# EAGLE design OCTO_CONTROLER_V1.2 (EAGLE 6.5.0)
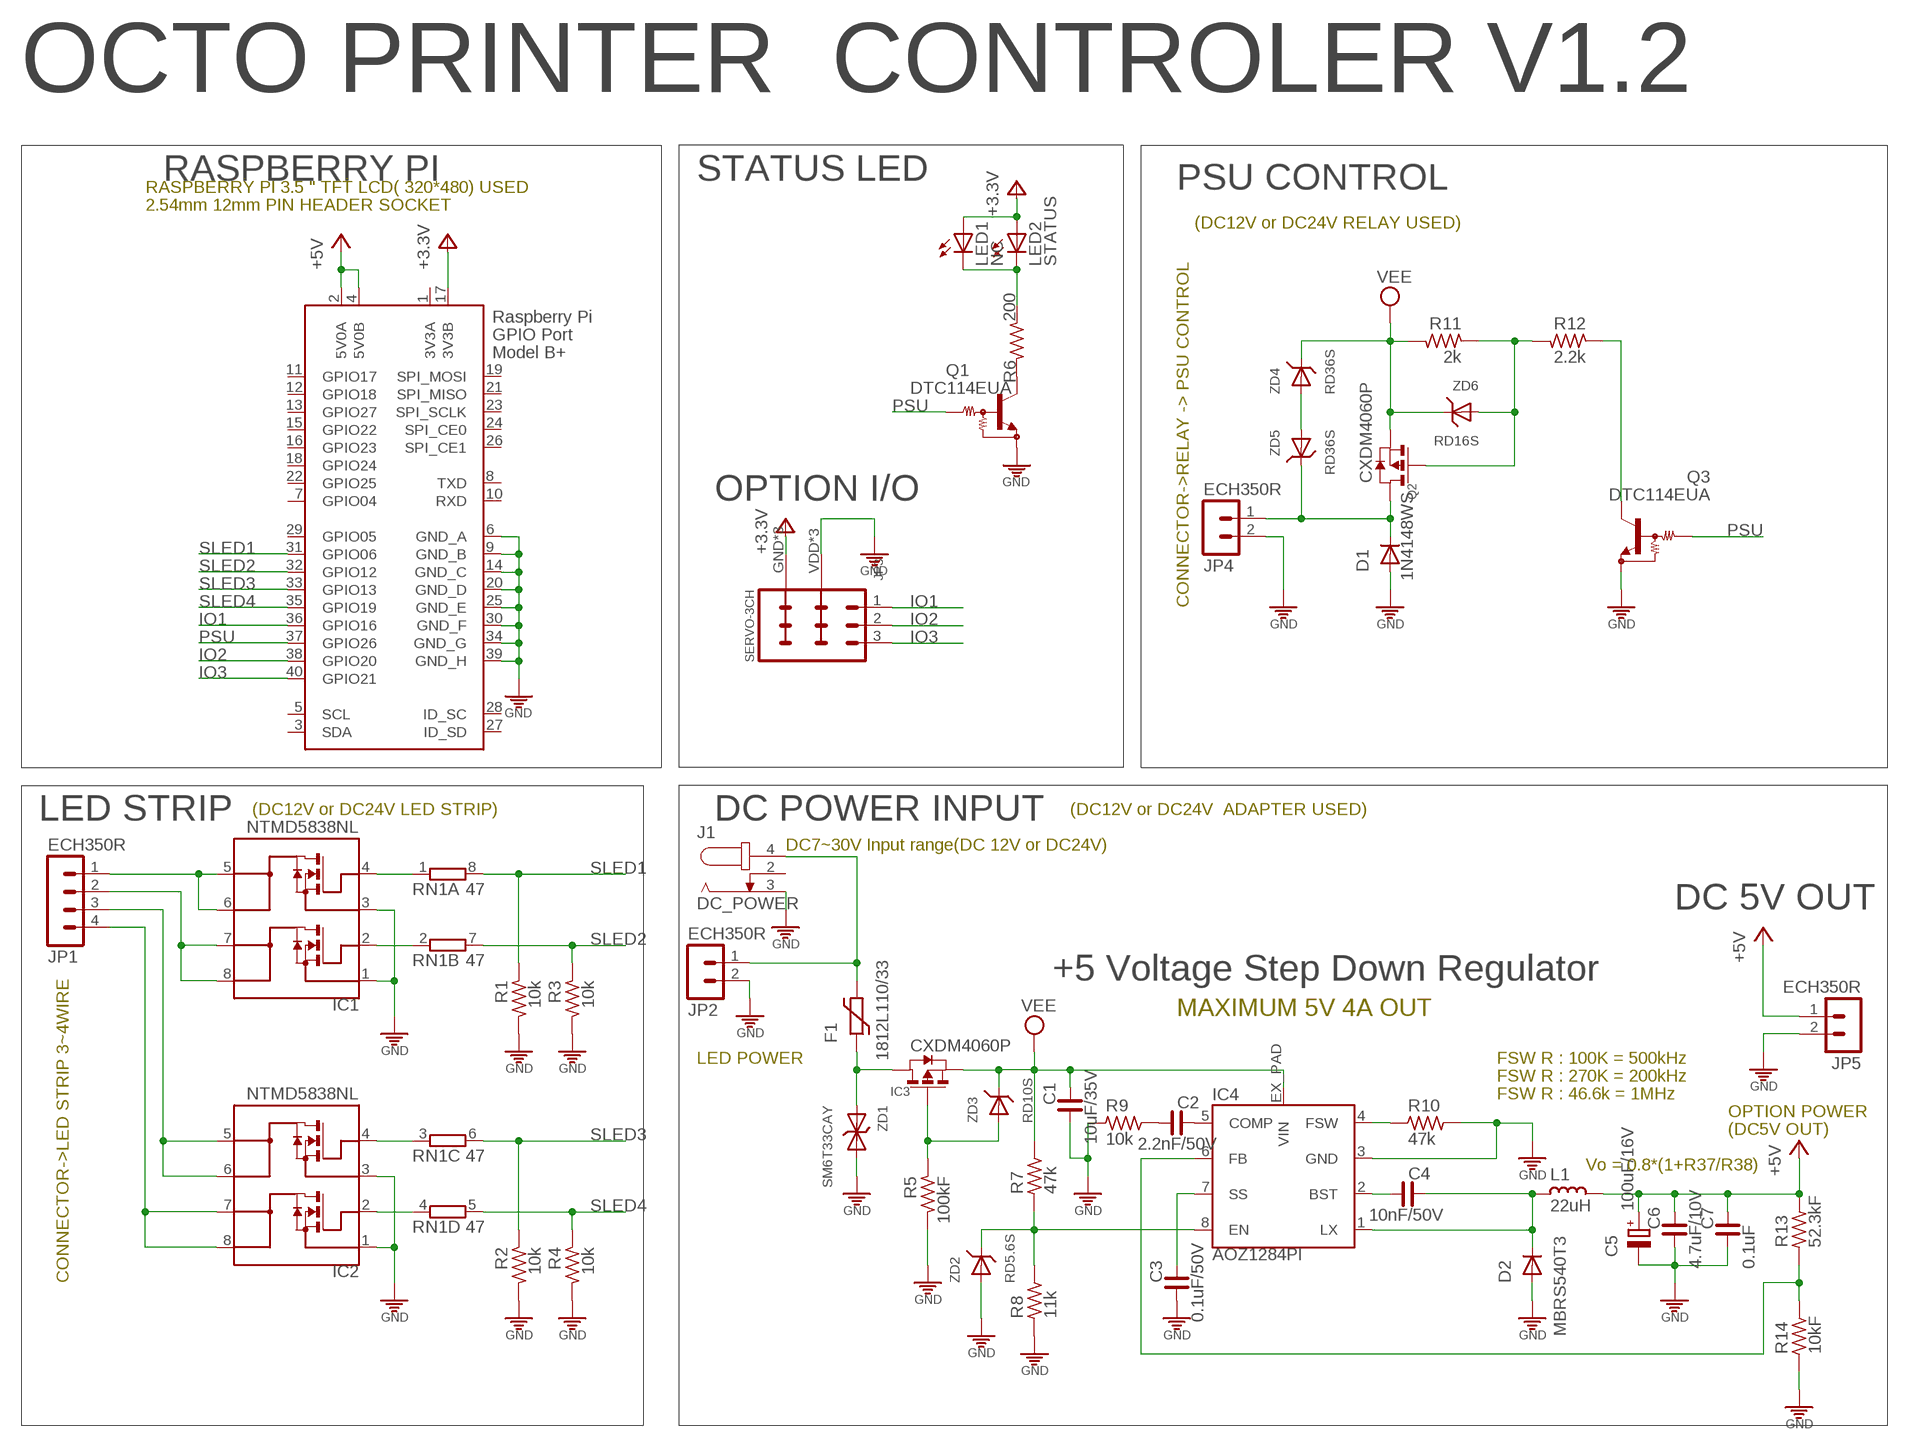
[diagram p0: schematic, sheet 1]

## Parts
C1  10uF/35V  C_3225  [C3225]
C2  2.2nF/50V  C_0603  [C0603]
C3  0.1uF/50V  C_0603  [C0603]
C4  10nF/50V  C_0603  [C0603]
C5  100uF/16V  CPOL-EUD/7343-31W  [D/7343-31W]
C6  4.7uF/10V  C_2012  [C2012]
C7  0.1uF  C_0603  [C0603]
D1  1N4148WS  B5189WN  [SOD323]
D2  MBRS540T3  DIODE-SMC  [SMC]
F1  1812L110/33  1812L  [1812L]
IC1  NTMD5838NL  N-DUAL-FET  [SO08]
IC2  NTMD5838NL  N-DUAL-FET  [SO08]
IC3  CXDM4060P  CXDM4060PCXDM4060P  [SOT89]
IC4  AOZ1284PI  [S08-EP1]
J1  DC_POWER  DC-JACK005A  [DC-005]
JP1  ECH350R  MA04-1ECHR350R  [ECH350R-04]
JP2  ECH350R  MA02ECH350R  [ECH350R-02]
JP3  SERVO-3CH  [SERVO-3CH1]
JP4  ECH350R  MA02ECH350R  [ECH350R-02]
JP5  ECH350R  MA02ECH350R  [ECH350R-02]
L1  22uH  L_SHP1260P-F  [SHP1260P-F]
LED1  NC  LEDSMD-1608  [LED-1608]
LED2  STATUS  LED3FG2HD-T1  [3FG2HD-T1]
Q1  DTC114EUA  [SC59-BEC]
Q2  CXDM4060P  CXDM4060PCXDM4060P  [SOT89]
Q3  DTC114EUA  [SC59-BEC]
R1  10k  R_0603  [R0603]
R2  10k  R_0603  [R0603]
R3  10k  R_0603  [R0603]
R4  10k  R_0603  [R0603]
R5  100kF  R_0603  [R0603]
R6  200  R_0603  [R0603]
R7  47k  R_0603  [R0603]
R8  11k  R_0603  [R0603]
R9  10k  R_0603  [R0603]
R10  47k  R_0603  [R0603]
R11  2k  R_0603  [R0603]
R12  2.2k  R_0603  [R0603]
R13  52.3kF  R_0603  [R0603]
R14  10kF  R_0603  [R0603]
RN1  47  4R-N  [ARRAY_R3216]
X1  RASPI_BOARD_B+#_F  [RASPI_BOARD_B+_FULL]
ZD1  SM6T33CAY  ZDSM6T33CAY  [SMB]
ZD2  RD5.6S  ZENER_DIODERD47S  [DSMM]
ZD3  RD10S  ZENER_DIODERD47S  [DSMM]
ZD4  RD36S  ZENER_DIODERD47S  [DSMM]
ZD5  RD36S  ZENER_DIODERD47S  [DSMM]
ZD6  RD16S  ZENER_DIODERD47S  [DSMM]

## Nets
3V3: JP3.GND JP3.GND@1(GND) JP3.GND@2(GND) LED1.A LED2.A X1.17(3V3B) ; supply symbol labelled +3V3
+5V: C5.+ C6.1 C7.1 JP5.1 L1.1 R13.2 X1.2(5V0A) X1.4(5V0B)
DC-IN: F1.P$1 IC3.2(D) IC3.2@1(D) ZD1.A
GND [GND]: C1.2 C3.2 C5.- C6.2 C7.2 D1.A D2.A IC1.1 IC1.3 IC2.1 IC2.3 IC4.3(GND) J1.3 JP2.2 JP3.VDD(+5V) JP3.VDD@1(+5V) JP3.VDD@2(+5V) JP4.2 JP5.2 Q1.1(GND) Q3.1(GND) R1.2 R2.2 R3.2 R4.2 R5.2 R8.1 R9.1 R10.2 R14.1 X1.6(GND_A) X1.9(GND_B) X1.14(GND_C) X1.20(GND_D) X1.25(GND_E) X1.30(GND_F) X1.34(GND_G) X1.39(GND_H) ZD1.C(K) ZD2.A
IO1: JP3.1 X1.36(GPIO16)
IO2: JP3.2 X1.38(GPIO20)
IO3: JP3.3 X1.40(GPIO21)
N$1: Q2.3(G) R11.1 R12.2 ZD6.A
N$2: LED1.C LED2.K(C) R6.1
N$3: ZD4.A ZD5.A
N$4: IC1.2 RN1.2
N$7: IC1.4 RN1.1
N$8: IC2.2 RN1.4
N$12: IC4.6(FB) R13.1 R14.2
N$13: IC2.4 RN1.3
N$14: C4.2 IC4.2(BST)
N$15: D1.C JP4.1 Q2.2(D) Q2.2@1(D) ZD5.C
N$27: C4.1 D2.C IC4.1(LX) L1.2
N$28: IC4.4(FSW) R10.1
N$29: C3.1 IC4.7(SS)
N$30: IC4.8(EN) R7.1 R8.2 ZD2.C
N$31: C2.1 IC4.5(COMP)
N$32: Q3.3(OUT) R12.1
N$34: C2.2 R9.2
N$77: Q1.3(OUT) R6.2
N$98: IC3.3(G) R5.1 ZD3.A
N$99: F1.P$2 J1.4 JP2.1
PSU: Q1.2(IN) Q3.2(IN) X1.37(GPIO26)
S-LED1: IC1.5 IC1.6 JP1.1
S-LED2: IC1.7 IC1.8 JP1.2
S-LED3: IC2.5 IC2.6 JP1.3
S-LED4: IC2.7 IC2.8 JP1.4
SLED1: R1.1 RN1.8 X1.31(GPIO06)
SLED2: R3.1 RN1.7 X1.32(GPIO12)
SLED3: R2.1 RN1.6 X1.33(GPIO13)
SLED4: R4.1 RN1.5 X1.35(GPIO19)
VEE: C1.1 IC3.1(S) IC4.EX_PAD(VIN) Q2.1(S) R7.2 R11.2 ZD3.C ZD4.C ZD6.C
Unconnected: J1.2 X1.3(SDA) X1.5(SCL) X1.7(GPIO04) X1.8(TXD) X1.10(RXD) X1.11(GPIO17) X1.12(GPIO18) X1.13(GPIO27) X1.15(GPIO22) X1.16(GPIO23) X1.18(GPIO24) X1.19(SPI_MOSI) X1.21(SPI_MISO) X1.22(GPIO25) X1.23(SPI_SCLK) X1.24(SPI_CE0) X1.26(SPI_CE1) X1.27(ID_SD) X1.28(ID_SC) X1.29(GPIO05)

## Notes on the sheet
- OCTO PRINTER  CONTROLER V1.2
- PSU CONTROL
- RASPBERRY PI 3.5 " TFT LCD( 320*480) USED | RASPBERRY PI | STATUS LED
- 2.54mm 12mm PIN HEADER SOCKET
- (DC12V or DC24V RELAY USED)
- OPTION I/O
- CONNECTOR->RELAY -> PSU CONTROL
- (DC12V or DC24V LED STRIP) | (DC12V or DC24V  ADAPTER USED)
- LED STRIP | DC POWER INPUT
- DC7~30V Input range(DC 12V or DC24V)
- DC 5V OUT
- +5 Voltage Step Down Regulator
- MAXIMUM 5V 4A OUT
- LED POWER | FSW R : 100K = 500kHz
- FSW R : 270K = 200kHz
- FSW R : 46.6k = 1MHz
- OPTION POWER
- (DC5V OUT)
- Vo = 0.8*(1+R37/R38)
- CONNECTOR->LED STRIP 3~4WIRE

## Power pins joined to a net without a drawn wire
3V3A: X1.1(3V3A)

## Library data of the parts
C1-C4 C6 C7 = cona_lib:C_: NON-POLARIZED CAP
C5 = cona_lib:CPOL-EU: POLARIZED CAPACITOR, European symbol
D1 = cona_lib:B5189W
D2 = diode:DIODE-: DIODE
F1 = ptc-littlefuse:1812L
IC1 IC2 = cona_lib:N-DUAL-FET
IC3 Q2 = cona_lib:CXDM4060P
IC4 = cona_lib:AOZ1284PI
J1 = cona_lib:DC-JACK
JP1 = cona_lib:MA04-1: PIN HEADER
JP2 JP4 JP5 = cona_lib:MA02
JP3 = cona_lib:SERVO-3CH
L1 = cona_lib:L_: INDUCTOR
LED1 LED2 = cona_lib:LED: LED OSRAM: - CHIPLED LG R971, LG N971, LY N971, LG Q971, LY Q971, LO R971, LY R971 LH N974, LH R974 LS Q976, LO Q976, LY Q976 LO Q996 - Hyper CHIPLED LW Q18S LB Q993, LB Q99A, LB R99A - SideLED LS A670, LO A670, LY A670, LG A670, LP A670 LB A673, LV A673, LT A673, LW A673 LH A674 LY A675 LS A676, LA A676, LO A676, LY A676, LW A676 LS A679, LY A679, LG A679 - Hyper Micro SIDELED® LS Y876, LA Y876, LO Y876, LY Y876 LT Y87S - SmartLED LW L88C, LW L88S LB L89C, LB L89S, LG L890 LS L89K, LO L89K, LY L89K LS L896, LA L896, LO L896, LY L896 - TOPLED LS T670, LO T670, LY T670, LG T670, LP T670 LSG T670, LSP T670, LSY T670, LOP T670, LYG T670 LG T671, LOG T671, LSG T671 LB T673, LV T673, LT T673, LW T673 LH T674 LS T676, LA T676, LO T676, LY T676, LB T676, LH T676, LSB T676, LW T676 LB T67C, LV T67C, LT T67C, LS T67K, LO T67K, LY T67K, LW E67C LS E67B, LA E67B, LO E67B, LY E67B, LB E67C, LV E67C, LT E67C LW T67C LS T679, LY T679, LG T679 LS T770, LO T770, LY T770, LG T770, LP T770 LB T773, LV T773, LT T773, LW T773 LH T774 LS E675, LA E675, LY E675, LS T675 LS T776, LA T776, LO T776, LY T776, LB T776 LHGB T686 LT T68C, LB T68C - Hyper Mini TOPLED® LB M676 - Mini TOPLED Santana® LG M470 LS M47K, LO M47K, LY M47K Source: http://www.osram.convergy.de LUXEON: - LUMILED® LXK2-PW12-R00, LXK2-PW12-S00, LXK2-PW14-U00, LXK2-PW14-V00 LXK2-PM12-R00, LXK2-PM12-S00, LXK2-PM14-U00 LXK2-PE12-Q00, LXK2-PE12-R00, LXK2-PE12-S00, LXK2-PE14-T00, LXK2-PE14-U00 LXK2-PB12-K00, LXK2-PB12-L00, LXK2-PB12-M00, LXK2-PB14-N00, LXK2-PB14-P00, LXK2-PB14-Q00 LXK2-PR12-L00, LXK2-PR12-M00, LXK2-PR14-Q00, LXK2-PR14-R00 LXK2-PD12-Q00, LXK2-PD12-R00, LXK2-PD12-S00 LXK2-PH12-R00, LXK2-PH12-S00 LXK2-PL12-P00, LXK2-PL12-Q00, LXK2-PL12-R00 Source: www.luxeon.com KINGBRIGHT: KA-3528ASYC Source: www.kingbright.com
Q1 Q3 = cona_lib:DTC114EUA: NPN Bias Resistor Transistor
R1-R14 = cona_lib:R_: RESISTOR
RN1 = cona_lib:4R-N: Array Chip Resistor Source: RS Component / Phycomp
X1 = raspberrypi_bastelstube_v13:RASPI_BOARD_B+#: Raspberry Pi GPIO connector with markings for the outer dimensions of the Raspberry Pi board model B+ with different sets of drill holes or mounting pads All pins connected
ZD1 = GRU-EURO6:ZD
ZD2-ZD6 = GRU-EURO6:ZENER_DIODE

## Net classes
0 default: clearance 0.152 mm
1 power: width 0.152 mm
2 GND: width 0.152 mm, clearance 0.152 mm

## Board
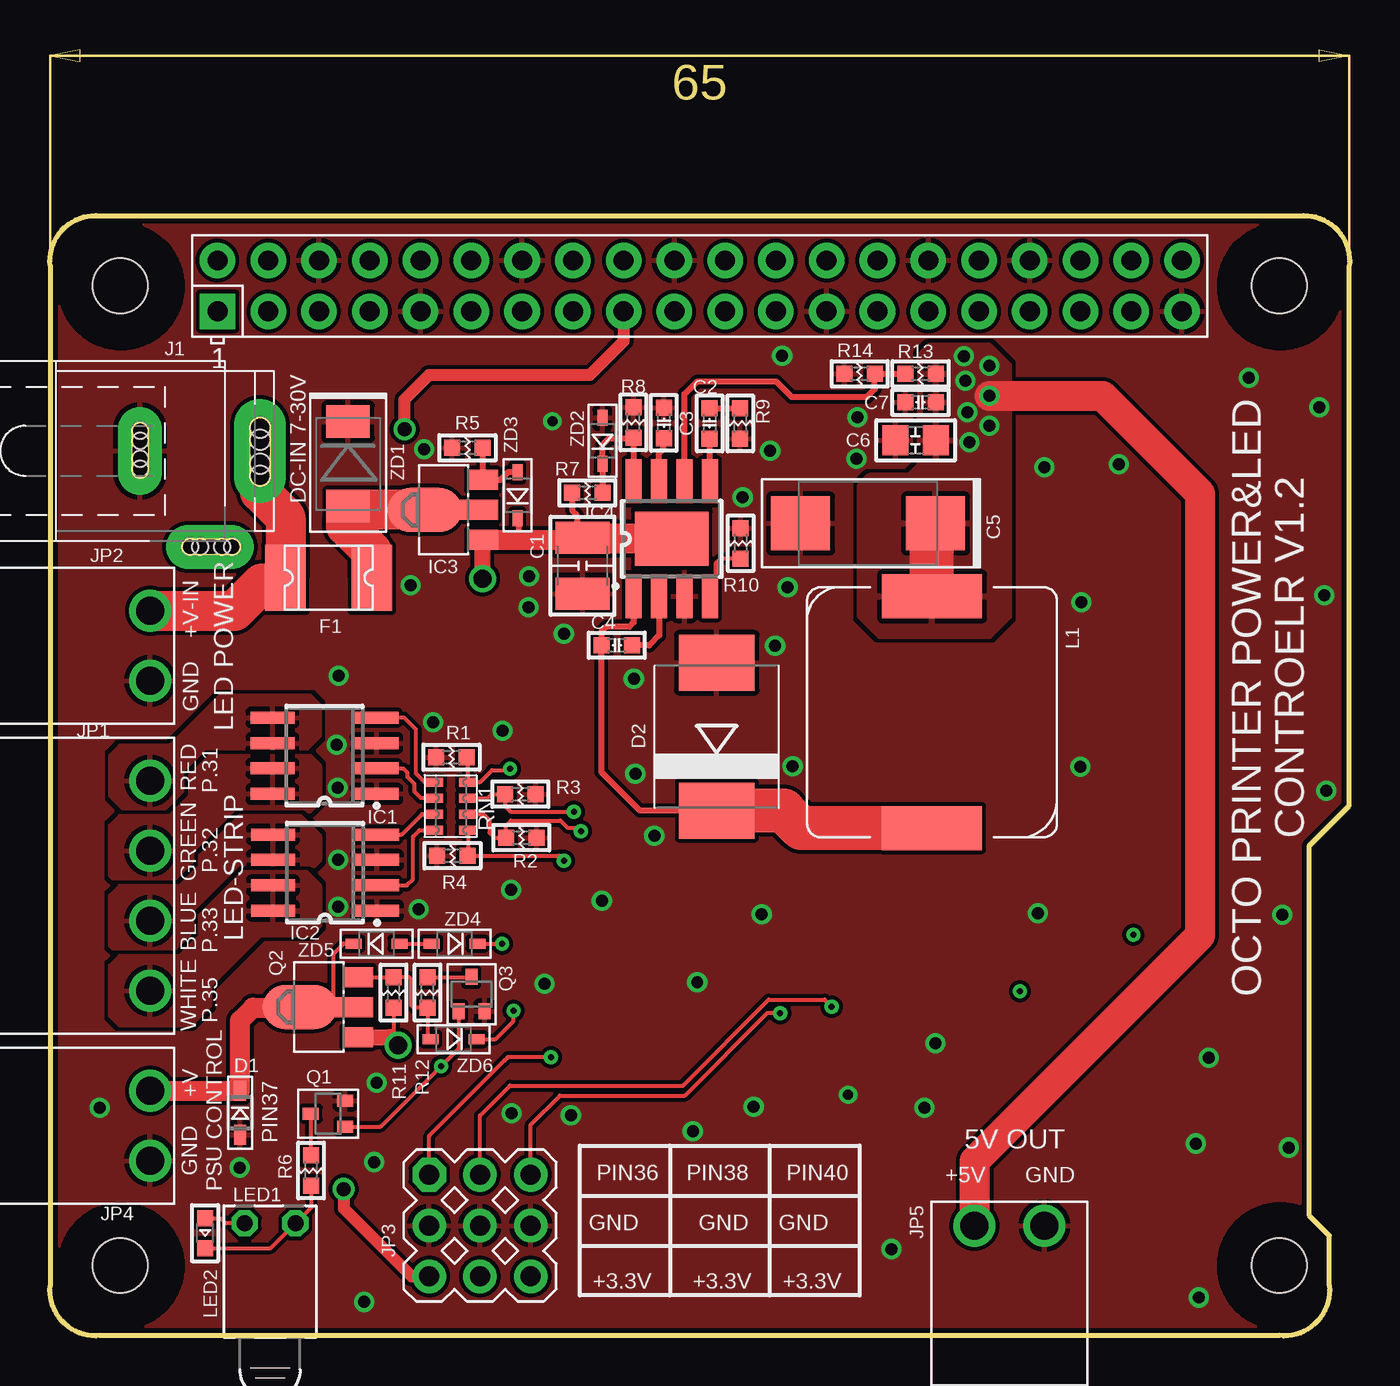
[diagram p1: board, top side]
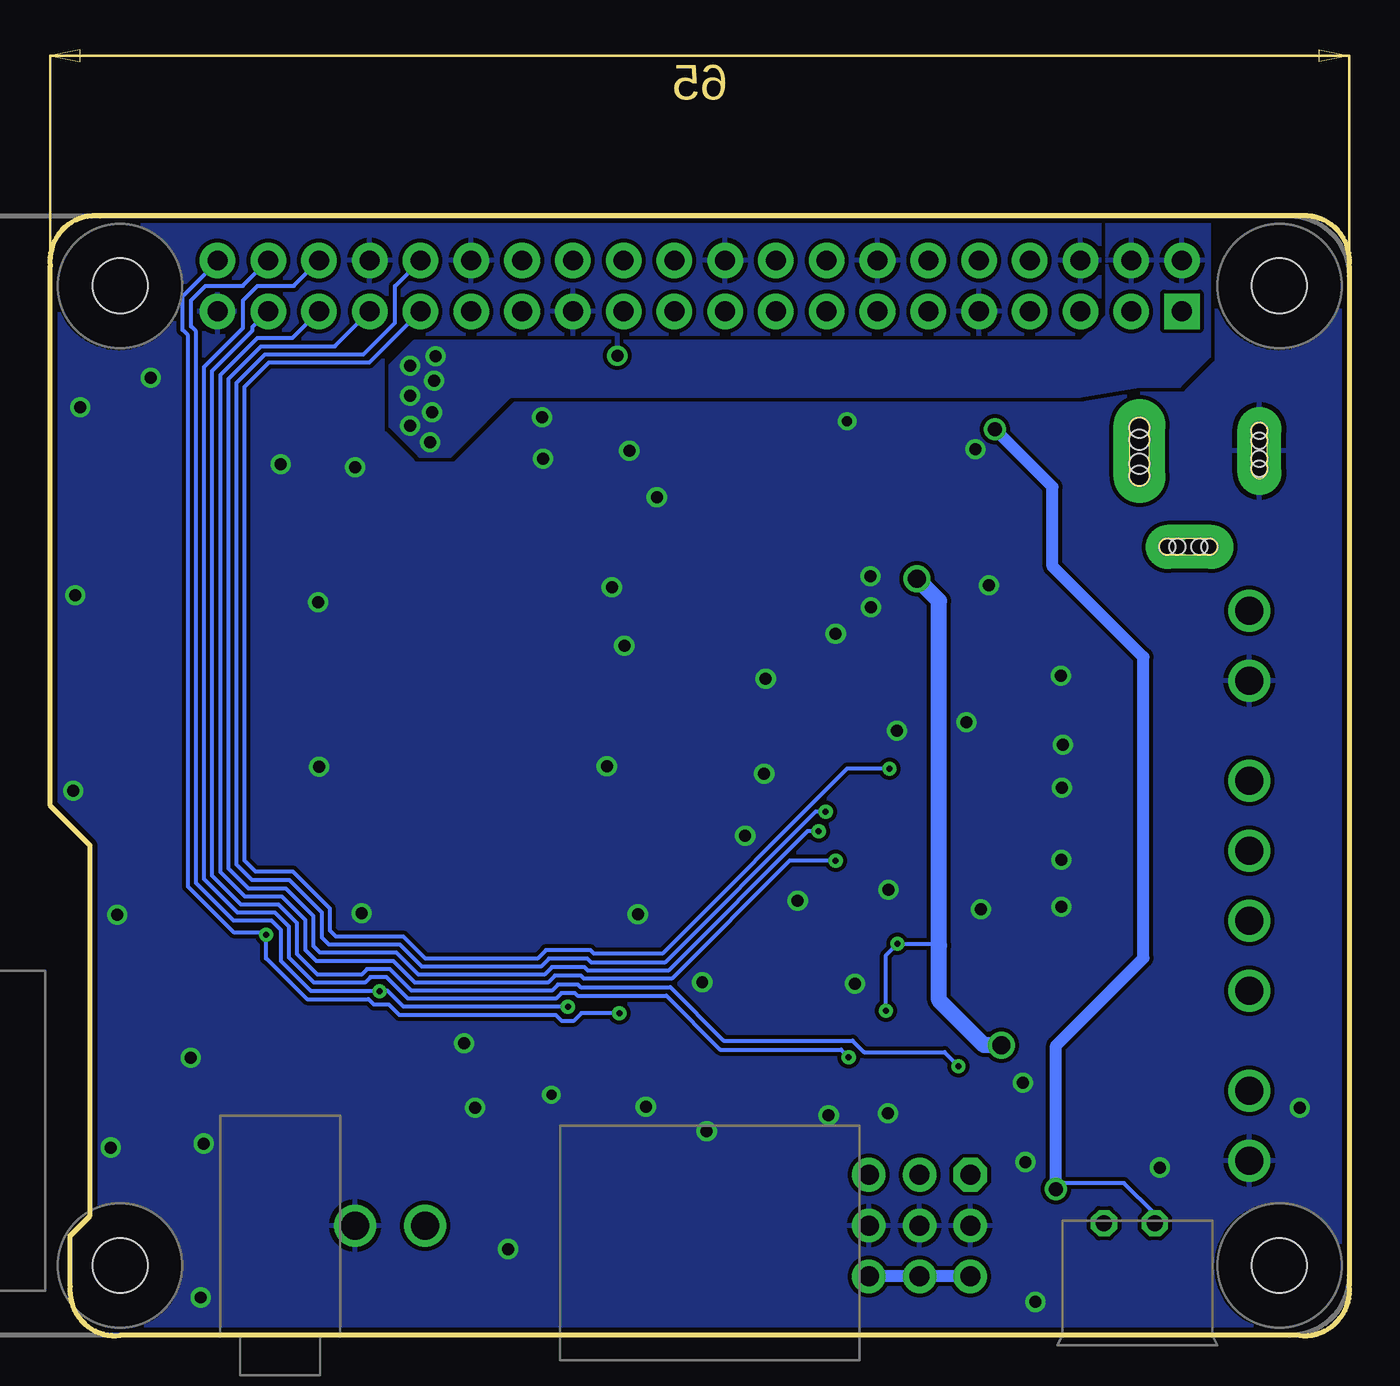
[diagram p2: board, bottom side, seen from below]

Size 65.03 x 56.03 mm. Coordinates in mm from the lower left corner, seen from the top.
Outline: 0.01,53.51 0.01,2.51 arc103 2.51,0.01 61.51,0.01 arc103 64.01,2.51 64.01,5.01 63.01,6.01 63.01,24.51 65.01,26.51 65.01,53.51 arc103 62.51,56.01 2.51,56.01 arc103 0.01,53.51
Copper layers (1*16): Top 0.035mm / dielectric 1.5mm / Bottom 0.035mm
Design rules "KHC_mm": minimum track width 0.2mm, minimum drill 0.3mm, track to track 0.2mm, track to pad 0.2mm, pad to pad 0.2mm, via to via 0.2mm, smd to smd 0.2mm, copper to edge 10mil, drill to drill 0.2mm, minimum pad ring 10mil, minimum via ring 8mil, stop-mask expansion 4mil, vias tented up to drill 0mil, thermal gap 10mil

### Footprints (pad centres in the part's own frame; a part is rotated, then mirrored left to right if it is on the bottom)
C3225 = smd 1.6 x 2.7: 1 -1.397,0; 2 1.397,0
C0603 = smd 0.8 x 0.8: 1 -0.762,0; 2 0.762,0
D/7343-31W = smd 2.95 x 2.7: + 3.375,0; - -3.375,0
C2012 = smd 1.3 x 1.5: 1 -1.016,0; 2 1.016,0
SOD323 = smd 1 x 0.6: A 1.1,0; C -1.1,0
SMC = smd 2.8 x 3.8: A 3.7,0; C -3.7,0
1812L = smd 2.03 x 3.3: P$1 -2.16,0; P$2 2.16,0
SO08 = smd 0.6 x 2.2: 1 -1.905,-2.6; 2 -0.635,-2.6; 3 0.635,-2.6; 4 1.905,-2.6; 5 1.905,2.6; 6 0.635,2.6; 7 -0.635,2.6; 8 -1.905,2.6
SOT89 = smd 1 x 1.5: 1 -1.499,-1.981; 3 1.499,-1.981 | smd 1 x 2: 2 0,-1.727 | smd 2.2 x 3.7: 2@1 0,0.94
S08-EP1 = smd 0.8 x 2.2: 1 -1.905,-2.87; 2 -0.635,-2.87; 3 0.635,-2.87; 4 1.905,-2.87; 5 1.905,2.87; 6 0.635,2.87; 7 -0.635,2.87; 8 -1.905,2.87 | smd 3.7 x 2.71: EX_PAD 0,0
DC-005 = drill 0.8 pad 2.2 long: 2 11,-4.8; 3 7.5,0 | drill 1 pad 2.6 long: 4 13.5,0 | hole 0.8: 7.5,1; 7.5,0.5; 7.5,-0.9; 7.5,-0.4; 10,-4.8; 10.5,-4.8; 12.1,-4.8; 11.6,-4.8 | hole 1: 13.5,1.15; 13.5,0.55; 13.5,-1.25; 13.5,-0.65
ECH350R-04 = drill 1.4: 1 -5.25,0; 2 -1.75,0; 3 1.75,0; 4 5.25,0
ECH350R-02 = drill 1.4: 1 -1.75,0; 2 1.75,0
SERVO-3CH1 = drill 1 pad 1.676 octagon: 1 -2.54,2.54 | drill 1 pad 1.676: 2 0,2.54; 3 2.54,2.54; GND -2.54,-2.54; GND@1 0,-2.54; GND@2 2.54,-2.54; VDD -2.54,0; VDD@1 0,0; VDD@2 2.54,0
SHP1260P-F = smd 2.2 x 5: 1 -5.8,0; 2 5.8,0
LED-1608 = smd 0.8 x 0.8: A -0.75,0; C 0.75,0
3FG2HD-T1 = drill 0.8 octagon: A -0.889,1.27; K -0.889,-1.27
SC59-BEC = smd 0.6 x 0.8: 1 0.65,-0.863; 2 -0.65,-0.863; 3 0,0.863
R0603 = smd 0.8 x 0.8: 1 -0.762,0; 2 0.762,0
ARRAY_R3216 = smd 0.45 x 0.9: 1 -1.2,-0.85; 2 -0.4,-0.85; 3 0.4,-0.85; 4 1.2,-0.85; 5 1.2,0.85; 6 0.4,0.85; 7 -0.4,0.85; 8 -1.2,0.85
RASPI_BOARD_B+_FULL = drill 1 pad 1.778 square: 1 8.37,51.23 | drill 1 pad 1.778: 2 8.37,53.77; 3 10.91,51.23; 4 10.91,53.77; 5 13.45,51.23; 6 13.45,53.77; 7 15.99,51.23; 8 15.99,53.77; 9 18.53,51.23; 10 18.53,53.77; 11 21.07,51.23; 12 21.07,53.77; 13 23.61,51.23; 14 23.61,53.77; 15 26.15,51.23; 16 26.15,53.77; 17 28.69,51.23; 18 28.69,53.77; 19 31.23,51.23; 20 31.23,53.77; 21 33.77,51.23; 22 33.77,53.77; 23 36.31,51.23; 24 36.31,53.77; 25 38.85,51.23; 26 38.85,53.77; 27 41.39,51.23; 28 41.39,53.77; 29 43.93,51.23; 30 43.93,53.77; 31 46.47,51.23; 32 46.47,53.77; 33 49.01,51.23; 34 49.01,53.77; 35 51.55,51.23; 36 51.55,53.77; 37 54.09,51.23; 38 54.09,53.77; 39 56.63,51.23; 40 56.63,53.77 | hole 2.75: 3.5,3.5; 3.5,52.5; 61.5,3.5; 61.5,52.5
SMB = smd 1.62 x 2.18: A 2.11,0; C -2.11,0
DSMM = smd 0.8 x 0.5: A 1.15,0; C -1.15,0

### Placement (x,y rotation side)
C1  26.64,38.51 270 top
C2  33.01,45.64 90 top
C3  30.71,45.66 90 top
C4  28.36,34.54 0 top
C5  40.94,40.64 0 top
C6  43.31,44.79 180 top
C7  43.56,46.69 180 top
D1  9.51,11.16 270 top
D2  33.36,29.96 90 top
F1  13.94,37.91 180 top
IC1  13.74,29.01 90 top
IC2  13.76,23.16 90 top
IC3  19.69,41.31 90 top
IC4  31.11,39.86 0 top
J1  -2.99,44.26 0 top
JP1  5.01,22.51 270 top
JP2  5.01,34.51 270 top
JP3  21.51,5.51 0 top
JP4  5.01,10.51 270 top
JP5  48.01,5.51 0 top
L1  44.14,31.19 270 top
LED1  7.76,5.14 270 top
LED2  11.01,6.51 90 top
Q1  13.91,11.11 90 top
Q2  13.44,16.44 90 top
Q3  21.09,17.09 0 top
R1  20.09,28.94 180 top
R2  23.59,24.91 0 top
R3  23.54,27.09 0 top
R4  20.14,24.01 180 top
R5  20.89,44.41 180 top
R6  13.06,8.26 90 top
R7  26.89,42.16 180 top
R8  29.19,45.69 270 top
R9  34.54,45.64 90 top
R10  34.56,39.64 90 top
R11  17.19,17.16 270 top
R12  18.89,17.16 270 top
R13  43.56,48.11 0 top
R14  40.51,48.11 0 top
RN1  20.06,26.49 270 top
X1  0.01,0.01 0 top
ZD1  14.91,43.61 270 top
ZD2  27.64,44.76 90 top
ZD3  23.39,42.04 90 top
ZD4  20.24,19.61 180 top
ZD5  16.34,19.61 0 top
ZD6  20.19,14.84 180 top

### Tracks (layer width: path | path; a pad name or v marks a point on that pad's centre or on a via)
3V3  (via drill 0.7)
  Top 0.2: LED2.A 8.8,5.62 8.56,5.86 7.79,5.86 LED1.A
  Top 0.6: v17.74,45.34 17.74,46.84 18.96,48.06 27.01,48.06 28.71,49.76 X1.17 | v14.69,7.34 14.71,7.31 14.71,6.36 18.1,2.97 JP3.GND
  Bottom 0.2: LED2.A 9.74,6.09 11.29,7.64 14.39,7.64 v14.69,7.34
  Bottom 0.6: v14.69,7.34 14.69,14.51 10.31,18.89 10.31,33.94 14.86,38.49 14.86,42.46 v17.74,45.34 | JP3.GND JP3.GND@1 JP3.GND@2
+5V  (via drill 0.6)
  Top 1.5: v47.01,47.01 52.66,47.01 57.54,42.14 57.54,20.01 46.26,8.74 JP5.1
  Top 2.2: L1.1 44.14,40.46 C5.+
  other vias: 47.01,48.51 47.01,45.51 45.81,47.76 45.91,46.19 46.01,44.69 45.74,48.99
  pour Top: 41.51,35.01 47.01,35.01 48.01,36.01 48.01,48.51 47.01,49.51 44.01,49.51 43.51,49.01 43.51,43.51 43.01,43.01 41.01,43.01 40.51,42.51 40.51,36.01
  pour Bottom: 7.01,56.01 12.14,56.01 12.14,50.99 13.41,49.71 46.81,49.71 48.01,48.51 48.01,45.51 46.51,44.01 45.01,44.01 42.01,47.01 13.51,47.01 10.51,47.51 8.51,47.51 7.01,49.01
DC-IN
  Top 0.2: 14.86,40.84 15.54,40.84 16.01,41.31
  Top 0.3: IC3.2@1 IC3.2
  Top 1: 14.86,40.84 14.86,41.45 ZD1.A
  Top 2: F1.P$1 16.1,39.23 14.81,40.51 14.81,40.79 14.86,40.84 | IC3.2@1 16.01,41.31 15.66,41.31 15.41,41.06
GND  (via drill 0.5, 0.6)
  other vias: 40.41,45.94 40.36,43.86 36.04,44.26 34.66,41.94 36.91,37.44 29.21,32.86 36.29,34.51 18.71,44.34 25.14,45.74 35.21,11.46 44.31,14.64 57.34,9.61 43.76,11.41 32.16,10.24 26.06,11.04 53.49,43.59 49.76,43.44 51.61,36.69 51.56,28.46 30.24,25.01 18.04,37.54 25.71,35.11 59.99,47.91 36.64,49.01 63.51,46.44 63.76,37.04 63.86,27.26 61.66,21.06 61.99,9.41 57.99,13.91 2.49,11.41 39.94,12.06 42.11,4.34 57.49,1.91 29.29,28.11 37.16,28.49 23.96,37.99 23.94,36.44 14.34,29.56 14.41,23.81 14.41,21.46 14.39,27.41 18.44,21.34 9.49,8.41 16.34,12.66 14.44,33.01 19.16,30.69 22.64,30.26 23.06,22.31 32.39,17.69 24.74,17.61 27.61,21.76 15.71,1.69 35.61,21.09 49.44,21.14 23.09,11.14 16.21,8.69
  pour Top (rank 5): 0.01,0.01 0.01,56.01 76.01,56.01 76.01,0.01
  pour Bottom (rank 4): 0.01,0.01 0.01,56.01 76.01,56.01 76.01,0.01
IO1  (via drill 0.3)
  Top 0.2: JP3.1 18.97,10 22.75,13.78 22.89,13.91 22.91,13.94 v25.06,13.94
  Bottom 0.2: X1.36 52.83,52.51 54.64,52.51 55.36,51.79 55.36,50.41 57.31,48.46 57.31,22.84 55.64,21.16 53.76,21.16 53.06,20.46 53.06,18.91 51.81,17.66 49.26,17.66 48.99,17.94 48.19,17.94 47.11,16.86 39.71,16.86 39.44,17.14 38.76,17.14 38.64,17.01 34.19,17.01 31.49,14.31 25.44,14.31 v25.06,13.94
IO2  (via drill 0.3)
  Top 0.2: v39.11,16.46 38.76,16.81 35.96,16.81 31.66,12.51 23.01,12.51 21.51,11.01 JP3.2
  Bottom 0.2: X1.38 55.37,52.51 57.24,52.51 57.96,51.79 57.96,50.49 57.71,50.24 57.71,22.64 55.84,20.76 53.94,20.76 53.46,20.29 53.46,18.74 51.96,17.24 v48.54,17.24 48.51,17.26 48.14,17.26 47.34,16.46 v39.11,16.46
IO3  (via drill 0.3)
  Top 0.2: v36.54,16.14 35.89,16.14 31.76,12.01 25.51,12.01 24.05,10.55 JP3.3
  Bottom 0.2: X1.40 56.64,53.73 58.39,51.99 58.39,50.31 58.11,50.04 58.11,22.46 55.84,20.19 54.34,20.19 v54.21,20.06 54.21,18.88 54.2,18.88 52.16,16.84 49.09,16.84 48.81,16.56 48.06,16.56 47.54,16.04 39.71,16.04 39.41,15.74 38.84,15.74 38.44,16.14 v36.54,16.14
N$1
  Top 0.2: ZD6.A 18.89,14.99 R12.2 18.2,16.4 18.06,16.54 18.06,17.84 17.96,17.94 17.2,17.94 R11.1 17.18,17.94 Q2.3
N$2
  Top 0.2: R6.1 13.06,6.4 LED2.K 11.05,4.39 LED1.C
N$3
  Top 0.2: ZD5.A ZD4.A
N$4
  Top 0.2: IC1.2 17.67,28.38 17.89,28.16 17.89,27.94 18.24,27.59 18.24,27.21 18.56,26.89 RN1.2
N$5
  cutout Top: 3.56,6.49 arc90 0.56,3.49 arc90 3.56,0.49 arc90 6.56,3.49 arc90
  cutout Bottom: 3.56,6.49 arc90 0.56,3.49 arc90 3.56,0.49 arc90 6.56,3.49 arc90
N$6
  cutout Top: 3.56,55.49 arc90 0.56,52.49 arc90 3.56,49.49 arc90 6.56,52.49 arc90
  cutout Bottom: 3.56,55.49 arc90 0.56,52.49 arc90 3.56,49.49 arc90 6.56,52.49 arc90
N$7
  Top 0.2: RN1.1 18.74,27.69 18.31,28.11 18.31,30.31 17.71,30.91 IC1.4
N$8
  Top 0.2: IC2.2 17.85,22.53 18.16,22.84 18.16,24.96 18.49,25.29 RN1.4
N$10
  cutout Top: 61.56,55.49 arc90 58.56,52.49 arc90 61.56,49.49 arc90 64.56,52.49 arc90
  cutout Bottom: 61.56,55.49 arc90 58.56,52.49 arc90 61.56,49.49 arc90 64.56,52.49 arc90
  cutout Bottom: 61.56,6.49 arc90 58.56,3.49 arc90 61.56,0.49 arc90 64.56,3.49 arc90
  cutout Top: 61.56,6.49 arc90 58.56,3.49 arc90 61.56,0.49 arc90 64.56,3.49 arc90
N$12
  Top 0.3: IC4.6 31.75,47.1 32.39,47.74 36.34,47.74 37.11,46.96 40.89,46.96 41.26,47.34 41.26,48.1 R14.2 R13.1
N$13
  Top 0.2: IC2.4 17.59,25.07 18.61,26.09 RN1.3
N$14
  Top 0.3: IC4.2 30.48,35.03 29.99,34.54 C4.2
N$15
  Top 0.2: ZD5.C 14.69,19.61 14.16,19.09 14.16,16.96 13.64,16.44
  Top 1: JP4.1 D1.C 9.51,15.76 10.16,16.41 12.47,16.41 Q2.2@1 13.64,16.44 Q2.2
N$27
  Top 0.3: IC4.1 29.21,35.68 28.99,35.46 27.81,35.46 27.59,35.24 27.59,34.55 C4.1 27.59,34.53 27.59,28.19 29.51,26.26 D2.C
  Top 2.2: L1.2 37.59,25.39 36.71,26.26 D2.C
N$28
  Top 0.2: R10.1 33.55,38.88 33.31,38.64 33.31,37.29 IC4.4
N$29
  Top 0.3: IC4.7 30.48,44.15 30.69,44.36 30.69,44.88 C3.1
N$30
  Top 0.3: 29.18,44.94 R8.2 | R8.2 29.19,42.75 IC4.8 | R7.1 27.64,42.18 ZD2.C 27.64,44.56 27.96,44.89 29.15,44.89 R8.2
N$31
  Top 0.3: IC4.5 C2.1
N$32
  Top 0.2: 18.88,17.94 R12.1 21.06,17.93 Q3.3
N$34
  Top 0.3: C2.2 R9.2
N$77
  Top 0.2: Q1.3 13.05,9.04 R6.2
N$98
  Top 0.3: R5.1 21.67,44.39 IC3.3 22.54,42.81 22.94,43.21 23.46,43.21 ZD3.A
N$99
  Top 2: JP2.1 9.24,36.26 10.61,37.64 11.5,37.64 F1.P$2 11.79,40.94 10.51,42.21 J1.4
PSU  (via drill 0.3)
  Top 0.2: Q1.2 16.54,10.46 v19.56,13.49 20.44,14.36 Q3.2
  Bottom 0.2: X1.37 54.89,50.46 54.89,50.29 56.91,48.26 56.91,23.01 55.46,21.56 53.59,21.56 52.66,20.64 52.66,19.09 51.64,18.06 49.44,18.06 49.16,18.34 48.01,18.34 46.94,17.26 39.91,17.26 39.61,17.56 38.61,17.56 38.49,17.44 33.99,17.44 31.31,14.76 24.86,14.76 24.29,14.19 20.26,14.19 v19.56,13.49
S-LED1
  pour Top (rank 4): 13.01,32.01 8.51,32.01 6.01,29.51 3.51,29.51 3.01,29.01 3.01,27.01 4.01,26.01 6.01,26.01 7.01,27.01 7.01,28.01 8.01,29.01 12.51,29.01 13.51,30.01 13.51,31.51
S-LED2
  pour Top (rank 3): 3.51,26.01 6.01,26.01 7.01,27.01 7.01,28.01 8.01,29.01 13.01,29.01 13.51,28.51 13.51,26.74 12.96,26.19 9.24,26.19 7.21,24.16 7.21,23.71 6.01,22.51 3.51,22.51 3.01,23.01 3.01,25.51
S-LED3
  pour Top (rank 2): 3.51,22.51 6.51,22.51 7.51,23.51 7.51,24.01 9.51,26.01 12.51,26.01 13.51,25.01 13.51,23.79 12.89,23.16 9.59,23.16 7.21,20.79 7.21,20.21 6.01,19.01 3.51,19.01 3.01,19.51 3.01,22.01
S-LED4
  pour Top: 3.51,19.01 6.51,19.01 7.51,20.01 7.51,21.04 9.69,23.21 12.81,23.21 13.51,22.51 13.51,20.51 13.01,20.01 10.51,20.01 8.01,17.51 8.01,16.51 7.01,15.51 3.51,15.51 3.01,16.01 3.01,18.51
SLED1  (via drill 0.3)
  Top 0.2: R1.1 20.91,28.88 RN1.8 21.51,27.69 22.11,28.29 22.94,28.29 v23.01,28.36
  Bottom 0.2: X1.31 49.04,48.69 54.06,48.69 55.29,47.46 55.29,23.76 54.74,23.21 52.86,23.21 51.01,21.36 51.01,20.26 50.71,19.96 47.34,19.96 46.24,18.86 40.64,18.86 40.21,19.29 37.99,19.29 37.81,19.11 34.39,19.11 25.14,28.36 v23.01,28.36
SLED2  (via drill 0.3)
  Top 0.2: RN1.7 21.89,26.89 22.09,27.09 R3.1 22.78,26.48 23.04,26.21 v26.21,26.21
  Bottom 0.2: X1.32 47.76,52.5 47.76,50.66 49.34,49.09 54.26,49.09 55.69,47.66 55.69,23.56 54.91,22.79 53.04,22.79 51.41,21.16 51.41,19.91 51.06,19.56 47.51,19.56 46.41,18.46 40.46,18.46 40.06,18.86 38.14,18.86 37.94,18.66 34.26,18.66 26.71,26.21 v26.21,26.21
SLED3  (via drill 0.3)
  Top 0.2: v26.56,25.24 26.39,25.41 25.89,25.41 25.54,25.76 23.06,25.76 22.83,25.53 R2.1 22.24,24.91 21.99,25.16 21.99,25.79 21.69,26.09 RN1.6
  Bottom 0.2: X1.33 50.78,49.49 54.46,49.49 56.09,47.86 56.09,23.36 55.09,22.36 53.21,22.36 51.84,20.99 51.84,19.49 51.51,19.16 47.69,19.16 46.59,18.06 40.29,18.06 39.91,18.44 38.29,18.44 38.11,18.26 34.09,18.26 27.11,25.24 v26.56,25.24
SLED4  (via drill 0.3)
  Top 0.2: RN1.5 20.91,24.03 R4.1 25.46,24.01 v25.71,23.76
  Bottom 0.2: X1.35 52.89,49.91 54.64,49.91 56.49,48.06 56.49,23.19 55.26,21.96 53.41,21.96 52.24,20.79 52.24,19.29 51.69,18.74 47.84,18.74 46.76,17.66 40.11,17.66 39.76,18.01 38.46,18.01 38.31,17.86 33.91,17.86 28.01,23.76 v25.71,23.76
VEE  (via drill 0.3, 0.9)
  Top 0.2: R11.2 17.19,15.12 17.01,14.94 | ZD4.C v22.61,19.61 | ZD6.C 22.29,14.84 23.19,15.74 v23.19,16.26
  Top 0.3: ZD3.C 23.49,39.84 23.51,39.81 | R7.2 26.13,41.28 26.36,41.04 26.36,40.19 C1.1
  Top 0.8: Q2.1 17.01,14.94 v17.41,14.54 | v21.64,37.86 21.64,39.78 IC3.1
  Top 1: IC3.1 23.51,39.81 26.46,39.81 C1.1
  Top 1.5: IC4.EX_PAD 26.52,39.86 C1.1
  Bottom 0.2: 20.54,19.51 20.64,19.61 v22.61,19.61 23.19,19.04 v23.19,16.26
  Bottom 0.8: v17.41,14.54 18.29,14.54 20.54,16.79 20.54,19.51 20.54,36.76 v21.64,37.86

### Text on the board
_tplace: DC-IN 7-30V | +V-IN | GND | LED POWER | RED | P.31 | CONTROELR V1.2 | GREEN | P.32 | LED-STRIP | BLUE | P.33 | OCTO PRINTER POWER&LED | P.35 | WHITE | PSU CONTROL | +V | PIN37 | PIN36 | PIN38 | PIN40 | 5V OUT | GND | +5V | GND | GND | GND | GND | +3.3V | +3.3V | +3.3V
207bmp: D:/TK/·ΰí/Open-source-hardware-logo.bmp